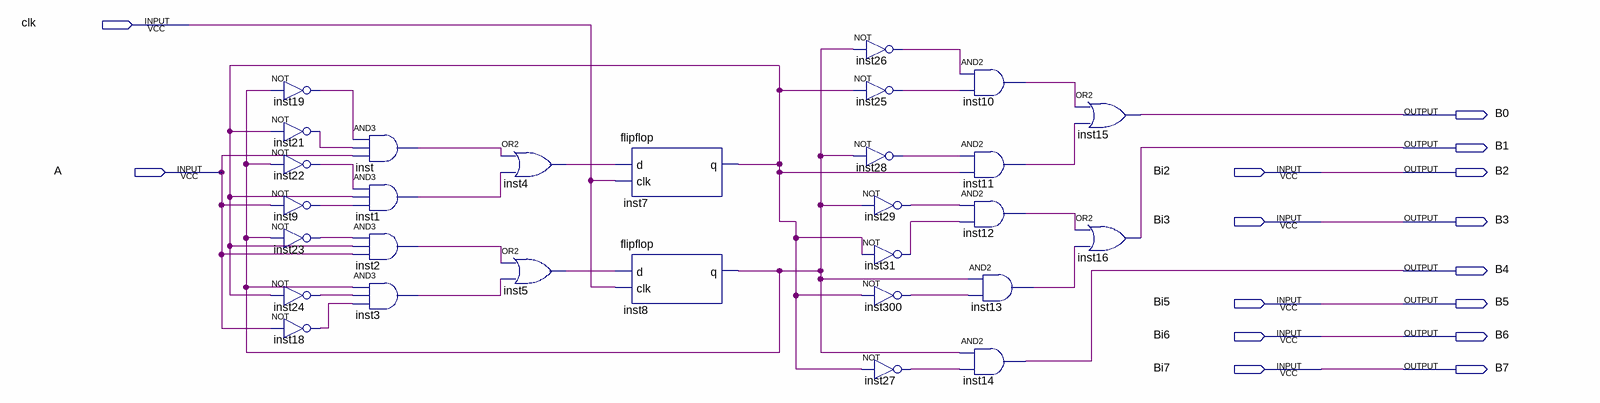
[diagram p0: schematic sheet]
// Quartus schematic fsm_sequenciador.bdf as structural Verilog: 29 symbols, 15 pins
module fsm_sequenciador (
  input  clk,
  input  A,
  input  Bi2,
  input  Bi3,
  input  Bi5,
  input  Bi6,
  input  Bi7,
  output B0,
  output B1,
  output B2,
  output B3,
  output B4,
  output B5,
  output B6,
  output B7
);

  wire inst1_out, inst2_out, inst3_out, inst4_out, inst5_out, inst7_q, inst8_q, inst9_out, inst10_out,
       inst11_out, inst12_out, inst13_out, inst18_out, inst19_out, inst21_out, inst22_out, inst23_out,
       inst24_out, inst25_out, inst26_out, inst27_out, inst28_out, inst29_out, inst31_out, inst300_out,
       inst_out;

  not inst19 (inst19_out, inst8_q);
  not inst21 (inst21_out, inst7_q);
  not inst22 (inst22_out, inst8_q);
  not inst9 (inst9_out, A);
  not inst23 (inst23_out, inst8_q);
  not inst24 (inst24_out, inst7_q);
  not inst18 (inst18_out, A);
  and inst (inst_out, inst19_out, inst21_out, A);
  and inst1 (inst1_out, inst22_out, inst7_q, inst9_out);
  and inst2 (inst2_out, inst23_out, inst7_q, A);
  and inst3 (inst3_out, inst8_q, inst24_out, inst18_out);
  or inst4 (inst4_out, inst_out, inst1_out);
  or inst5 (inst5_out, inst2_out, inst3_out);
  flipflop inst7 (.d(inst4_out), .clk(clk), .q(inst7_q));
  flipflop inst8 (.d(inst5_out), .clk(clk), .q(inst8_q));
  not inst26 (inst26_out, inst8_q);
  not inst25 (inst25_out, inst7_q);
  not inst28 (inst28_out, inst8_q);
  not inst29 (inst29_out, inst8_q);
  not inst31 (inst31_out, inst7_q);
  not inst300 (inst300_out, inst7_q);
  not inst27 (inst27_out, inst7_q);
  and inst10 (inst10_out, inst26_out, inst25_out);
  and inst11 (inst11_out, inst28_out, inst7_q);
  and inst12 (inst12_out, inst29_out, inst31_out);
  and inst13 (inst13_out, inst8_q, inst300_out);
  and inst14 (B4, inst8_q, inst27_out);
  or inst15 (B0, inst10_out, inst11_out);
  or inst16 (B1, inst12_out, inst13_out);

  assign B2 = Bi2;
  assign B3 = Bi3;
  assign B5 = Bi5;
  assign B6 = Bi6;
  assign B7 = Bi7;
endmodule
